# Altium schematic sheet thermocouple.SchDoc
size A4
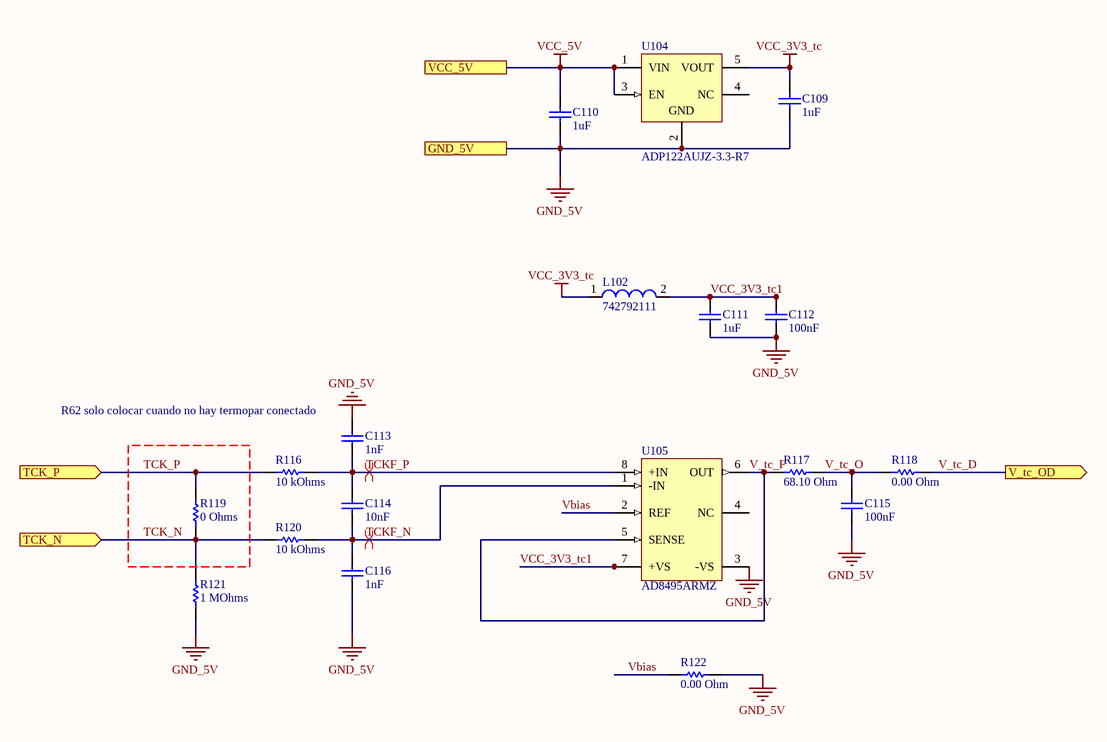
[diagram p0: thermocouple.SchDoc]

## Parts
C109  value 1uF  [CAPC0603(1608)100_N]  (hidden comment: CAP 1uF 50V 0603(1608))
C110  value 1uF  [CAPC0603(1608)100_N]  (hidden comment: CAP 1uF 50V 0603(1608))
C111  value 1uF  [CAPC0603(1608)100_L]  (hidden comment: CAP 1uF 50V 0603(1608))
C112  value 100nF  [CAPC0603(1608)100_L]  (hidden comment: CAP 100nF 50V 0603(1608))
C113  value 1nF  [CAPC0603(1608)100_L]  (hidden comment: CAP 1nF 25V 0603(1608))
C114  value 10nF  [CAPC0603(1608)100_L]  (hidden comment: CAP 10nF 25V 0603(1608))
C115  value 100nF  [CAPC0603(1608)100_N]  (hidden comment: CAP 100nF 10V 0603(1608))
C116  value 1nF  [CAPC0603(1608)100_L]  (hidden comment: CAP 1nF 25V 0603(1608))
L102  742792111  [SMD-1206]
R116  value 10 kOhms  [RESC3116X65X50NL20T20]  (hidden comment: CRCW120610K0FKEAHP)
R117  value 68.10 Ohm  [RESC0805(2012)_N]  (hidden comment: 68R1 1% 0805(2012))
R118  value 0.00 Ohm  [RESC0603(1608)_N]  (hidden comment: Jumper 0603(1608))
R119  value 0 Ohms  [RESC3216X60X45LL10T20]  (hidden comment: CRCW12060000Z0EB)
R120  value 10 kOhms  [RESC3116X65X50NL20T20]  (hidden comment: CRCW120610K0FKEAHP)
R121  value 1 MOhms  [RESC3216X70X50LL05T20]  (hidden comment: ERJ-8GEYJ105V)
R122  value 0.00 Ohm  [RESC0603(1608)_L]  (hidden comment: Jumper 0603(1608))
U104  ADP122AUJZ-3.3-R7  [ADI-UJ-5_L]
U105  AD8495ARMZ  [DGK0008A_L]

## Ports
GND_5V, TCK_N (in), TCK_P (in), V_tc_OD (out), VCC_5V

## Nets
GND_5V: C109.1 C110.1 C111.1 C112.1 C113.1 C115.1 C116.2 R121.1 R122.2 U104.2(GND) U105.3(-VS) ; port GND_5V
VCC_3V3_tc: C109.2 L102.1 U104.5(VOUT)
VCC_5V: C110.2 U104.1(VIN) U104.3(EN) ; port VCC_5V
TCK_N: R119.1 R120.2 R121.2 ; port TCK_N
TCK_P: R116.2 R119.2 ; port TCK_P
TCKF_N: C114.2 C116.1 R120.1 U105.1(-IN)
TCKF_P: C113.2 C114.1 R116.1 U105.8(+IN)
V_tc_D: R118.1 ; port V_tc_OD
V_tc_F: R117.2 U105.5(SENSE) U105.6(OUT)
V_tc_O: C115.2 R117.1 R118.2
Vbias: R122.1 U105.2(REF)
VCC_3V3_tc1: C111.2 C112.2 L102.2 U105.7(+VS)

Not connected (* = marked no-connect by the designer): U104 4(NC); U105 4(NC)

## Layout directives
differential pair: TCKF_N, TCKF_P

## Notes on the sheet
- (near C113) R62 solo colocar cuando no hay termopar conectado

## Library data of the parts
C109-C111 = CMP-1035-02746-1: CAP 1uF 50V ±20% 0603 (1608 Metric) Thickness 1mm SMD; Tolerance: Â±20%; Case-EIA: 0603; Case-Metric: 1608; Technology: SMT; Max Thickness: 1 mm; Rated Voltage: 50 V
C112 = CMP-1035-02591-1: CAP 100nF 50V ±5% 0603 (1608 Metric) Thickness 1mm SMD; Tolerance: Â±5%; Case-Metric: 1608; Case-EIA: 0603; Rated Voltage: 50 V; Max Thickness: 1 mm; Technology: SMT
C113 C116 = CMP-1035-01883-1: CAP 1nF 25V ±5% 0603 (1608 Metric) Thickness 1mm SMD; Case-EIA: 0603; Tolerance: Â±5%; Case-Metric: 1608; Technology: SMT; Rated Voltage: 25 V; Max Thickness: 1 mm
C114 = CMP-1035-02316-1: CAP 10nF 25V ±5% 0603 (1608 Metric) Thickness 1mm SMD; Tolerance: Â±5%; Case-EIA: 0603; Case-Metric: 1608; Rated Voltage: 25 V; Technology: SMT; Max Thickness: 1 mm
C115 = CMP-1035-02580-1: CAP 100nF 10V ±10% 0603 (1608 Metric) Thickness 1mm SMD; Tolerance: Â±10%; Case-EIA: 0603; Case-Metric: 1608; Max Thickness: 1 mm; Rated Voltage: 10 V; Technology: SMT
L102 = CMP-0220-00024-1: SMD EMI Suppression Ferrite Bead WE-CBF, Z = 26 Ohm; Impedance: 26 Ohm; ComponentLink2Description: Datasheet; PackageReference: SMD-1206; ComponentLink2URL: http://www.we-online.de/katalog/media/pdf/742792111.pdf; PackageVersion: 2007; DatasheetVersion: Dec-2005; PackageDescription: Chip Inductor, 2-Leads, Body 3.2 x 1.6 mm; ComponentLink1URL: http://www.we-online.com; ComponentLink1Description: Manufacturer Link
R116 R120 = CMP-2003-04883-1: Manufacturer: Vishay Dale; Precision: 1%; Part Number: CRCW120610K0FKEAHP; Package: 1206
R117 = CMP-1013-00379-1: 68R1 0.125W 1% 0805 (2012 Metric)  SMD; Case-EIA: 0805; Case-Metric: 2012; Power: 0.125 W; Tolerance: 1 %; Technology: SMT
R118 R122 = CMP-1012-00001-1: Jumper 0603 (1608 Metric); Case-Metric: 1608; Power: None; Case-EIA: 0603; Technology: SMT; Tolerance: None
R119 = CMP-2003-04797-1: Manufacturer: Vishay Dale; Part Number: CRCW12060000Z0EB; Package: 1206
R121 = CMP-2003-00547-1: Manufacturer: Panasonic; Precision: 5%; Part Number: ERJ-8GEYJ105V; Package: 1206
U104 = CMP-0786-00346-1: 300 mA, Low Quiescent Current, CMOS Linear Regulator, 2.3 to 5.5 V Vin, 3.3 V Vout, Industrial, 5-pin SOT23 (UJ-5), Reel; Manufacturer: Analog Devices; Vin (min) (V): 2.3; Supply Current IGND @ Small Load: 45uA; Vin (max) (V): 5.5; Iout max: 300mA; Preset Vout Values (V): 3.3; ComponentLink4Description: URL Link1; ComponentLink4URL: Product URL:http://www.analog.com/en/ADP122/productSearch.html; ComponentLink2URL: http://www.analog.com/static/imported-files/data_sheets/ADP122_123.pdf; PackageDescription: 5-Pin Thin Small Outline Transistor Package, Body 2.9 x 1.6 mm, Pitch 0.95 mm; ComponentLink1URL: http://www.analog.com/en/index.html; ComponentLink3URL: http:/www.analog.com/static/imported-files/packages/PKG_PDF/TSOT(UJ)/UJ_5.pdf; ComponentLink2Description: Datasheet; PartNumber: ADP122AUJZ-3.3-R7; Packing: Reel; ComponentLink1Description: Manufacturer URL; Code_JEDEC: MO-193-AB; PackageVersion: 100708-A, 10/2008; PackageReference: UJ-5; Mounting Technology: Surface Mount; DatasheetVersion: Rev. E; ComponentLink3Description: Package Specification
U105 = AD8495ARMZ: Full K-Type Thermocouple Amplifier with Cold Junction Compensation, Industrial, 8-pin SOP (RM-8), Tube; Manufacturer: Analog Devices; ComponentLink3URL: http://www.analog.com/static/imported-files/packages/PKG_PDF/MSOP%28RM%29/RM_8.pdf; ComponentLink4URL: http://www.analog.com/en/mems-sensors/digital-temperature-sensors/ad8495/products/product.html; ComponentLink1URL: http://www.analog.com/en/index.html; PartNumber: AD8495ARMZ; PackageVersion: 08/2005; PackageReference: RM-8; PackageDescription: 8-Pin Mini Small Outline Package, Body 3 x 3 mm, Pitch 0.65 mm; ComponentLink1Description: Manufacturer URL; Code_JEDEC: MO-187-AA; ComponentLink2URL: http://www.analog.com/static/imported-files/data_sheets/AD8494_8495_8496_8497.pdf; Mounting Technology: Surface Mount; ComponentLink4Description: Product URL; ComponentLink3Description: Package Specification; Packing: Tube; ComponentLink2Description: Datasheet; DatasheetVersion: Rev. C; Supplier 1: Digi-Key; Supplier 2: Arrow; Supplier 3: Mouser; Supplier 4: Farnell; Supplier Part Number 1: AD8495ARMZ-ND; Supplier Part Number 2: AD8495ARMZ; Supplier Part Number 3: 584-AD8495ARMZ; Supplier Part Number 4: 1864707